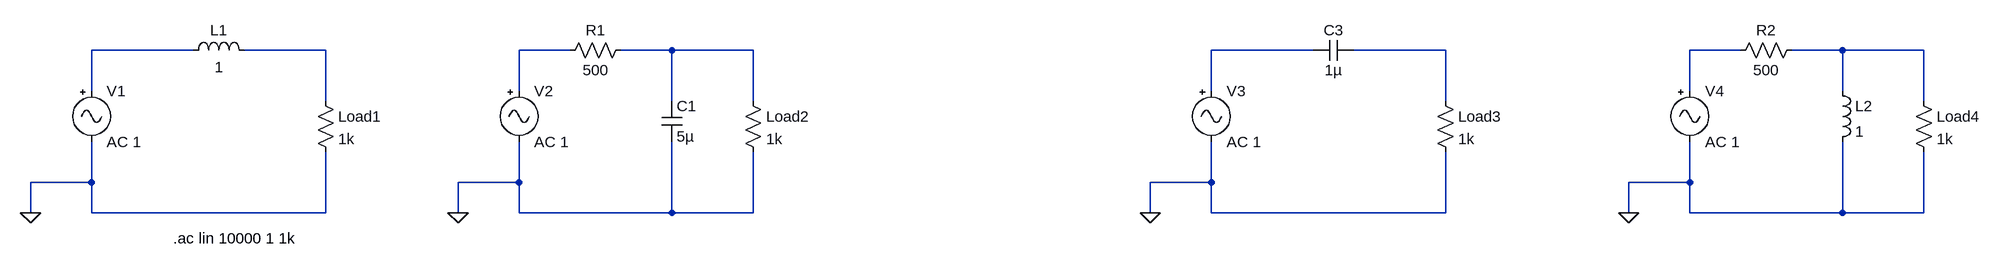
[diagram p0: schematic Filters.asc]
Filters.asc, the LTspice schematic file:
Version 4.1
SHEET 1 3024 680
WIRE 208 0 48 0
WIRE 416 0 288 0
WIRE 800 0 720 0
WIRE 960 0 880 0
WIRE 1088 0 960 0
WIRE 1968 0 1808 0
WIRE 2176 0 2032 0
WIRE 2640 0 2560 0
WIRE 2800 0 2720 0
WIRE 2928 0 2800 0
WIRE 48 64 48 0
WIRE 720 64 720 0
WIRE 1808 64 1808 0
WIRE 2560 64 2560 0
WIRE 2800 64 2800 0
WIRE 416 80 416 0
WIRE 960 80 960 0
WIRE 1088 80 1088 0
WIRE 2176 80 2176 0
WIRE 2928 80 2928 0
WIRE 48 208 48 144
WIRE 48 208 -48 208
WIRE 720 208 720 144
WIRE 720 208 624 208
WIRE 1808 208 1808 144
WIRE 1808 208 1712 208
WIRE 2560 208 2560 144
WIRE 2560 208 2464 208
WIRE -48 256 -48 208
WIRE 48 256 48 208
WIRE 416 256 416 160
WIRE 416 256 48 256
WIRE 624 256 624 208
WIRE 720 256 720 208
WIRE 960 256 960 144
WIRE 960 256 720 256
WIRE 1088 256 1088 160
WIRE 1088 256 960 256
WIRE 1712 256 1712 208
WIRE 1808 256 1808 208
WIRE 2176 256 2176 160
WIRE 2176 256 1808 256
WIRE 2464 256 2464 208
WIRE 2560 256 2560 208
WIRE 2800 256 2800 144
WIRE 2800 256 2560 256
WIRE 2928 256 2928 160
WIRE 2928 256 2800 256
FLAG -48 256 0
FLAG 624 256 0
FLAG 1712 256 0
FLAG 2464 256 0
SYMBOL Misc\\signal 48 48 R0
WINDOW 123 0 0 Left 0
WINDOW 39 0 0 Left 0
SYMATTR InstName V1
SYMATTR Value AC 1
SYMBOL res 400 64 R0
SYMATTR InstName Load1
SYMATTR Value 1k
SYMBOL ind 192 16 R270
WINDOW 0 32 56 VTop 2
WINDOW 3 5 56 VBottom 2
SYMATTR InstName L1
SYMATTR Value 1
SYMATTR SpiceLine Rser=0
SYMBOL Misc\\signal 720 48 R0
WINDOW 123 0 0 Left 0
WINDOW 39 0 0 Left 0
SYMATTR InstName V2
SYMATTR Value AC 1
SYMBOL res 1072 64 R0
SYMATTR InstName Load2
SYMATTR Value 1k
SYMBOL cap 944 80 R0
SYMATTR InstName C1
SYMATTR Value 5µ
SYMBOL res 784 16 R270
WINDOW 0 32 56 VTop 2
WINDOW 3 0 56 VBottom 2
SYMATTR InstName R1
SYMATTR Value 500
SYMBOL Misc\\signal 1808 48 R0
WINDOW 123 0 0 Left 0
WINDOW 39 0 0 Left 0
SYMATTR InstName V3
SYMATTR Value AC 1
SYMBOL res 2160 64 R0
SYMATTR InstName Load3
SYMATTR Value 1k
SYMBOL cap 2032 -16 R90
WINDOW 0 0 32 VBottom 2
WINDOW 3 32 32 VTop 2
SYMATTR InstName C3
SYMATTR Value 1µ
SYMBOL Misc\\signal 2560 48 R0
WINDOW 123 0 0 Left 0
WINDOW 39 0 0 Left 0
SYMATTR InstName V4
SYMATTR Value AC 1
SYMBOL res 2912 64 R0
SYMATTR InstName Load4
SYMATTR Value 1k
SYMBOL res 2624 16 R270
WINDOW 0 32 56 VTop 2
WINDOW 3 0 56 VBottom 2
SYMATTR InstName R2
SYMATTR Value 500
SYMBOL ind 2784 48 R0
SYMATTR InstName L2
SYMATTR Value 1
SYMATTR SpiceLine Rser=0
TEXT 176 296 Left 2 !.ac lin 10000 1 1k

The netlist it stands for:
* Filters.asc
V1 N001 0 AC 1
R§Load1 N002 0 1k
L1 N001 N002 1 Rser=0
V2 N003 0 AC 1
R§Load2 N004 0 1k
C1 N004 0 5µ
R1 N003 N004 500
V3 N005 0 AC 1
R§Load3 N006 0 1k
C3 N006 N005 1µ
V4 N007 0 AC 1
R§Load4 N008 0 1k
R2 N007 N008 500
L2 N008 0 1 Rser=0
.ac lin 10000 1 1k
.backanno
.end